# Altium schematic sheet memory.SchDoc
size A4; SheetNumber: 3; SheetTotal: 8
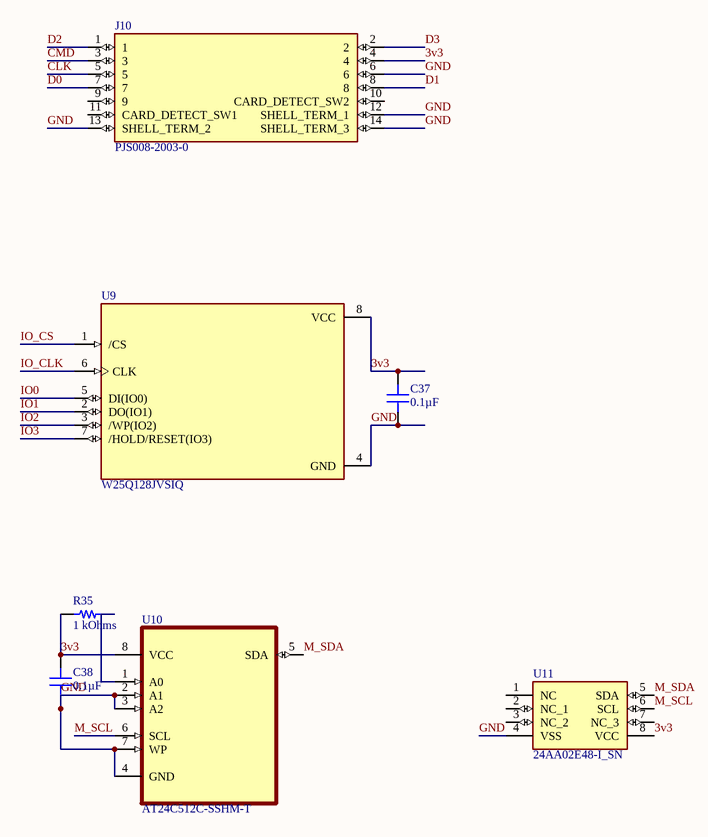
[diagram p0: memory.SchDoc]

## Parts
C37  Capacitance: 0.1µF  [CAP 0805_2012]  (hidden comment: 1µF)
C38  Capacitance: 0.1µF  [CAP 0805_2012]  (hidden comment: 1µF)
J10  PJS008-2003-0  [PJS008-2003-0]
R35  1 kOhms  [RES 0805_2012]
U9  W25Q128JVSIQ  [SOIC127P790X216-8N]
U10  AT24C512C-SSHM-T  [SOIC127P600X175-8N]
U11  24AA02E48-I_SN  [SOIC127P600X175-8N]

## Nets
3v3: C37.2 C38.2 J10.4 R35.1 U9.8(VCC) U10.8(VCC) U11.8(VCC)
CLK: J10.5
CMD: J10.3
D0: J10.7
D1: J10.8
D2: J10.1
D3: J10.2
GND: C37.1 C38.1 J10.6 J10.12(SHELL_TERM_1) J10.13(SHELL_TERM_2) J10.14(SHELL_TERM_3) U9.4(GND) U10.2(A1) U10.3(A2) U10.4(GND) U10.7(WP) U11.4(VSS)
IO0: U9.5(DI(IO0))
IO1: U9.2(DO(IO1))
IO2: U9.3(/WP(IO2))
IO3: U9.7(/HOLD/RESET(IO3))
IO_CLK: U9.6(CLK)
IO_CS: U9.1(/CS)
M_SCL: U10.6(SCL) U11.6(SCL)
M_SDA: U10.5(SDA) U11.5(SDA)
NetR35_2: R35.2 U10.1(A0)

Not connected (* = marked no-connect by the designer): J10 9 10(CARD_DETECT_SW2) 11(CARD_DETECT_SW1); U11 1(NC) 2(NC_1) 3(NC_2) 7(NC_3)

## Library data of the parts
C37 C38 = 0805ZC105KAT4A: CAP CER 1UF 10V X7R 0805; manufacturer: AVX Corporation; Tolerance: ±10%; Part Number: 0805ZC105KAT4A; Applications: General Purpose; componentlink1description: Datasheet; componentlink1url: http://datasheets.avx.com/X7RDielectric.pdf; componentlink2description: DigiKey Link; componentlink2url: http://digikey.com/product-detail/en/avx-corporation/0805ZC105KAT4A/478-7604-1-ND/7536237; Device Package: 0805 (2012 Metric); lastupdated: 02-09-2020 1.04.40 AM; Lifecycle Status: Active; Minimum Order: 1; Mounting Type: Surface Mount, MLCC; Operating Temperature: -55°C ~ 125°C; Package / Case: 0805 (2012 Metric); packaging: TapeAndReel; partid: 3500; Part Status: Active; price: 0.17; series: -; Size / Dimension: 0.079" L x 0.049" W (2.00mm x 1.25mm); Supplier 1: DigiKey; Supplier Part Number 1: 478-7604-1-ND; Temperature Coefficient: X7R; Thickness (Max): 0.037" (0.94mm); value: 1µF; Voltage - Rated: 10V
J10 = PJS008-2003-0: Memory Card Connectors MicroSD Crd Conn SMT Revrs Mnt Push-Push; MF: Yamaichi Electronics; SnapEDA_Link: https://www.snapeda.com/parts/PJS008-2003-0/ICH/view-part/?ref=snap; Package: None; Value: *; MP: PJS008-2003-0; Check_prices: https://www.snapeda.com/parts/PJS008-2003-0/ICH/view-part/?ref=eda
R35 = ESR10EZPF1001: RES SMD 1K OHM 1% 0.4W 0805; Manufacturer: Rohm Semiconductor; Power (Watts): 0.4W, 2/5W; Temperature Coefficient: ±100ppm/°C; Part Number: ESR10EZPF1001; Value: 1 kOhms; ComponentLink1Description: Datasheet; ComponentLink1URL: https://www.rohm.com/datasheet/ESR01MZPF/esr-e; ComponentLink2Description: DigiKey Link; ComponentLink2URL: https://www.digikey.com/en/products/detail/rohm-semiconductor/ESR10EZPF1001/1983480; Composition: Thick Film; Device Package: 0805 (2012 Metric); Features: Automotive AEC-Q200, Pulse Withstanding; Height - Seated (Max): 0.026" (0.65mm); LastUpdated: 08-02-2024 9.02.37 PM; Lifecycle Status: Active; Minimum Order: 1; Number of Terminations: 2; Operating Temperature: -55°C ~ 155°C; Package / Case: 0805 (2012 Metric); Packaging: TapeAndReel; PartId: 28032; Part Status: Active; Price: 0.02; Ratings: AEC-Q200; Resistance: 1 kOhms; Series: ESR; Size / Dimension: 0.079" L x 0.049" W (2.00mm x 1.25mm); Supplier 1: DigiKey; Supplier Part Number 1: RHM1.00KAECT-ND; Supplier Device Package: 0805; Tolerance: ±1%
U9 = W25Q128JVSIQ: FLASH - NOR Memory IC 128Mb (16M x 8) SPI - Quad I/O, QPI, DTR 133 MHz 8-SOIC; MF: Winbond Electronics; SnapEDA_Link: https://www.snapeda.com/parts/W25Q128JVSIQ/Winbond/view-part/?ref=snap; Package: SOIC-8 Winbond Electronics; Value: *; MP: W25Q128JVSIQ; Check_prices: https://www.snapeda.com/parts/W25Q128JVSIQ/Winbond/view-part/?ref=eda
U10 = AT24C512C-SSHM-T: EEPROM Memory IC 512Kb (64K x 8) IÂ²C 400 kHz 900 ns 8-SOIC; MF: Microchip; SnapEDA_Link: https://www.snapeda.com/parts/AT24C512C-SSHM-T/Microchip/view-part/?ref=snap; Package: SO-8 Microchip; Value: *; MP: AT24C512C-SSHM-T; Check_prices: https://www.snapeda.com/parts/AT24C512C-SSHM-T/Microchip/view-part/?ref=eda
U11 = 24AA02E48-I_SN: Microchip 24AA02E48-I/SN Serial EEPROM Memory,2kb,3500ns,1.7 to 5.5V 8-Pin SOIC | Microchip Technology Inc. 24AA02E48-I/SN; SnapEDA_Link: https://www.snapeda.com/parts/24AA02E48-I/SN/Microchip/view-part/?ref=snap; Package: SO-8 Microchip; Value: *; MF: Microchip; MP: 24AA02E48-I/SN; Check_prices: https://www.snapeda.com/parts/24AA02E48-I/SN/Microchip/view-part/?ref=eda